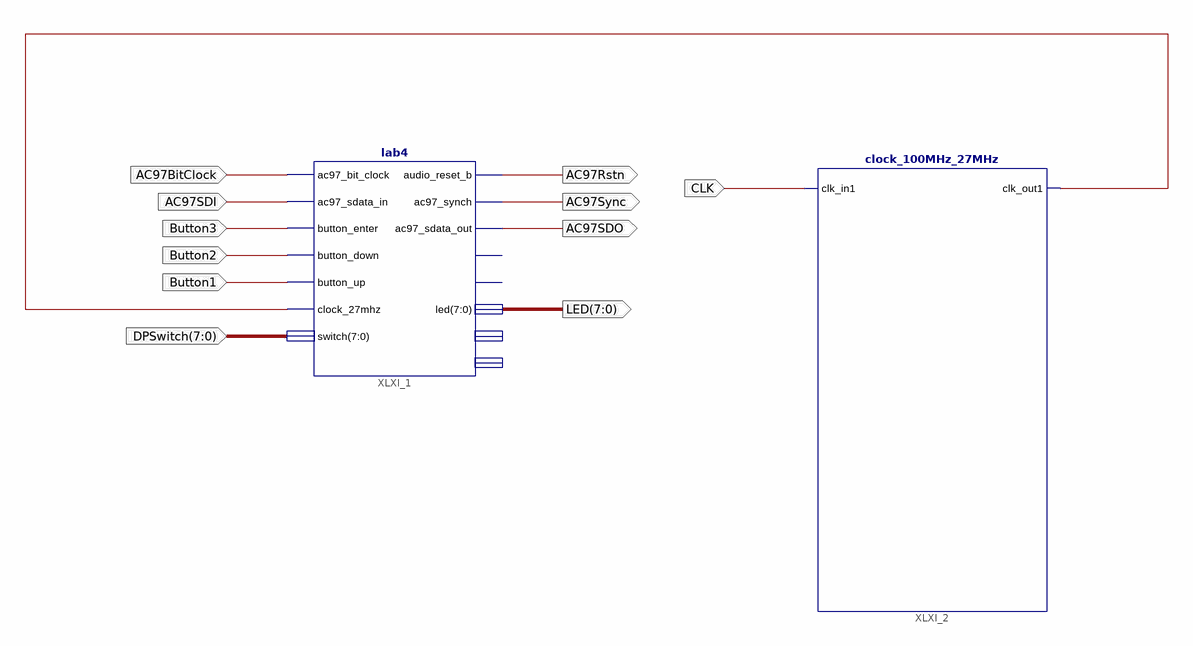
[diagram p0: schematic sheet 1]
// Xilinx ISE schematic Lab4Schematic.sch (spartan6) as structural Verilog: 2 symbols, 11 ports
module Lab4Schematic (
  input  [7:0] DPSwitch,
  input  Button1,
  input  Button2,
  input  Button3,
  input  AC97SDI,
  input  AC97BitClock,
  input  CLK,
  output AC97Rstn,
  output AC97Sync,
  output AC97SDO,
  output [7:0] LED
);

  wire clk_27mhz;

  lab4 XLXI_1 (
    .ac97_bit_clock(AC97BitClock), .ac97_sdata_in(AC97SDI), .button_enter(Button3), .button_down(Button2),
    .button_up(Button1), .clock_27mhz(clk_27mhz), .switch(DPSwitch), .audio_reset_b(AC97Rstn),
    .ac97_synch(AC97Sync), .ac97_sdata_out(AC97SDO), .led(LED));  // open: analyzer1_clock, analyzer3_clock, analyzer1_data, analyzer3_data
  clock_100MHz_27MHz XLXI_2 (.clk_in1(CLK), .clk_out1(clk_27mhz));
endmodule
